# EAGLE board rizon-smd (EAGLE 8.4.1)
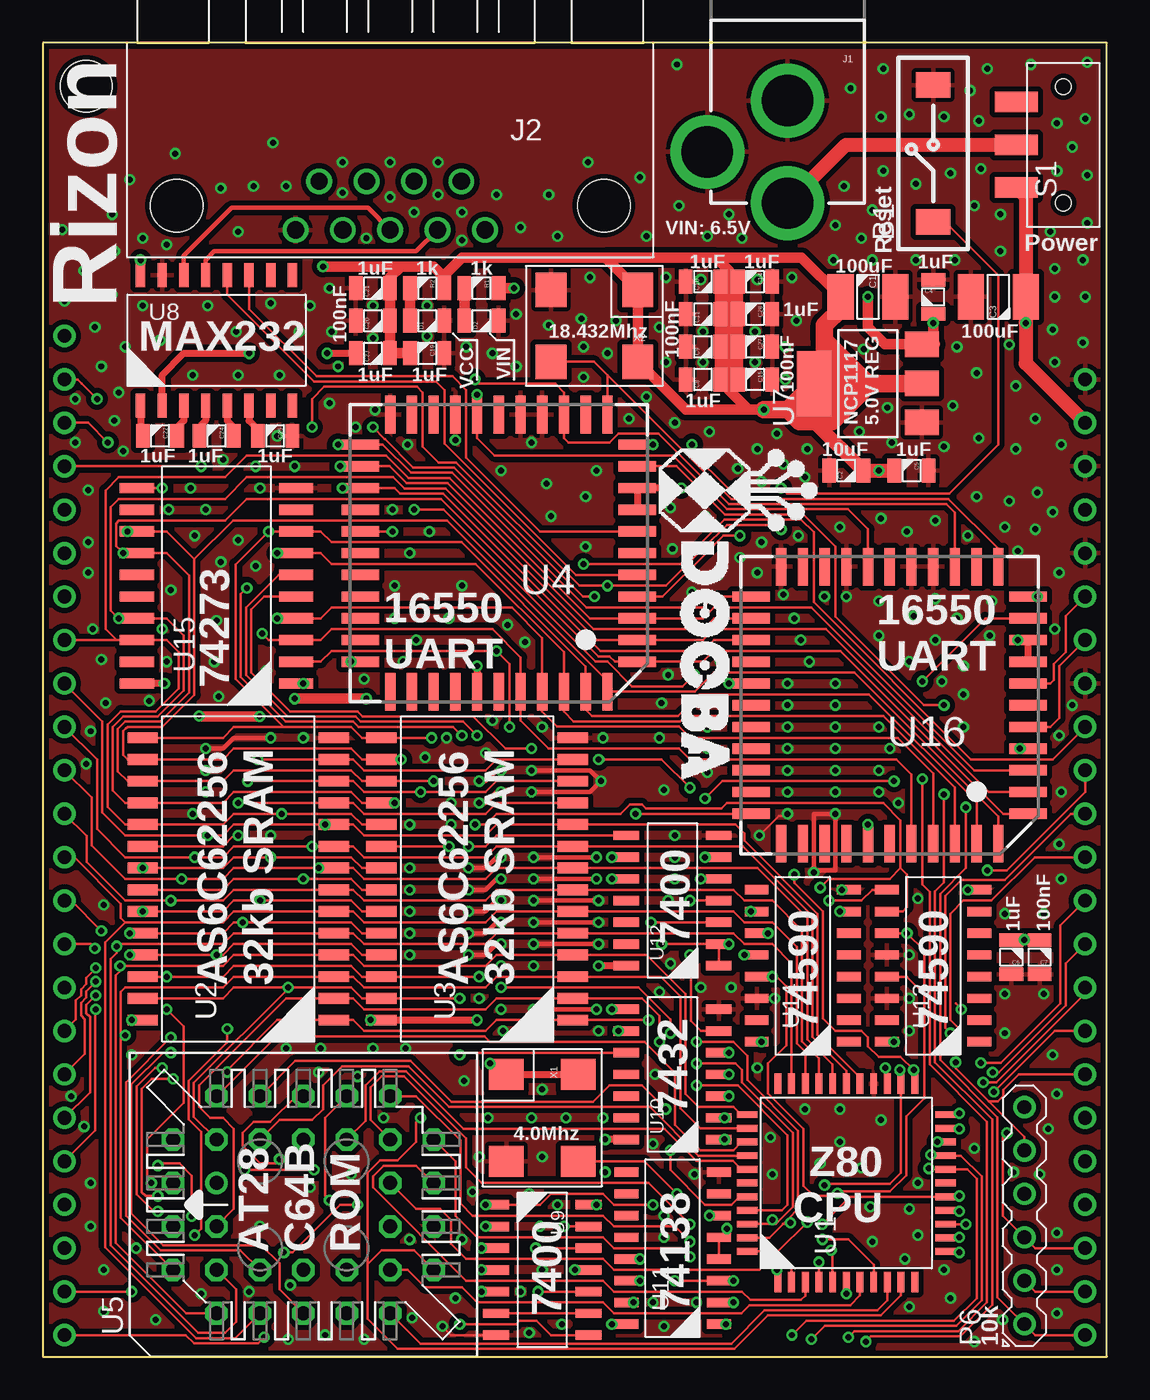
[diagram p5: board, top side]
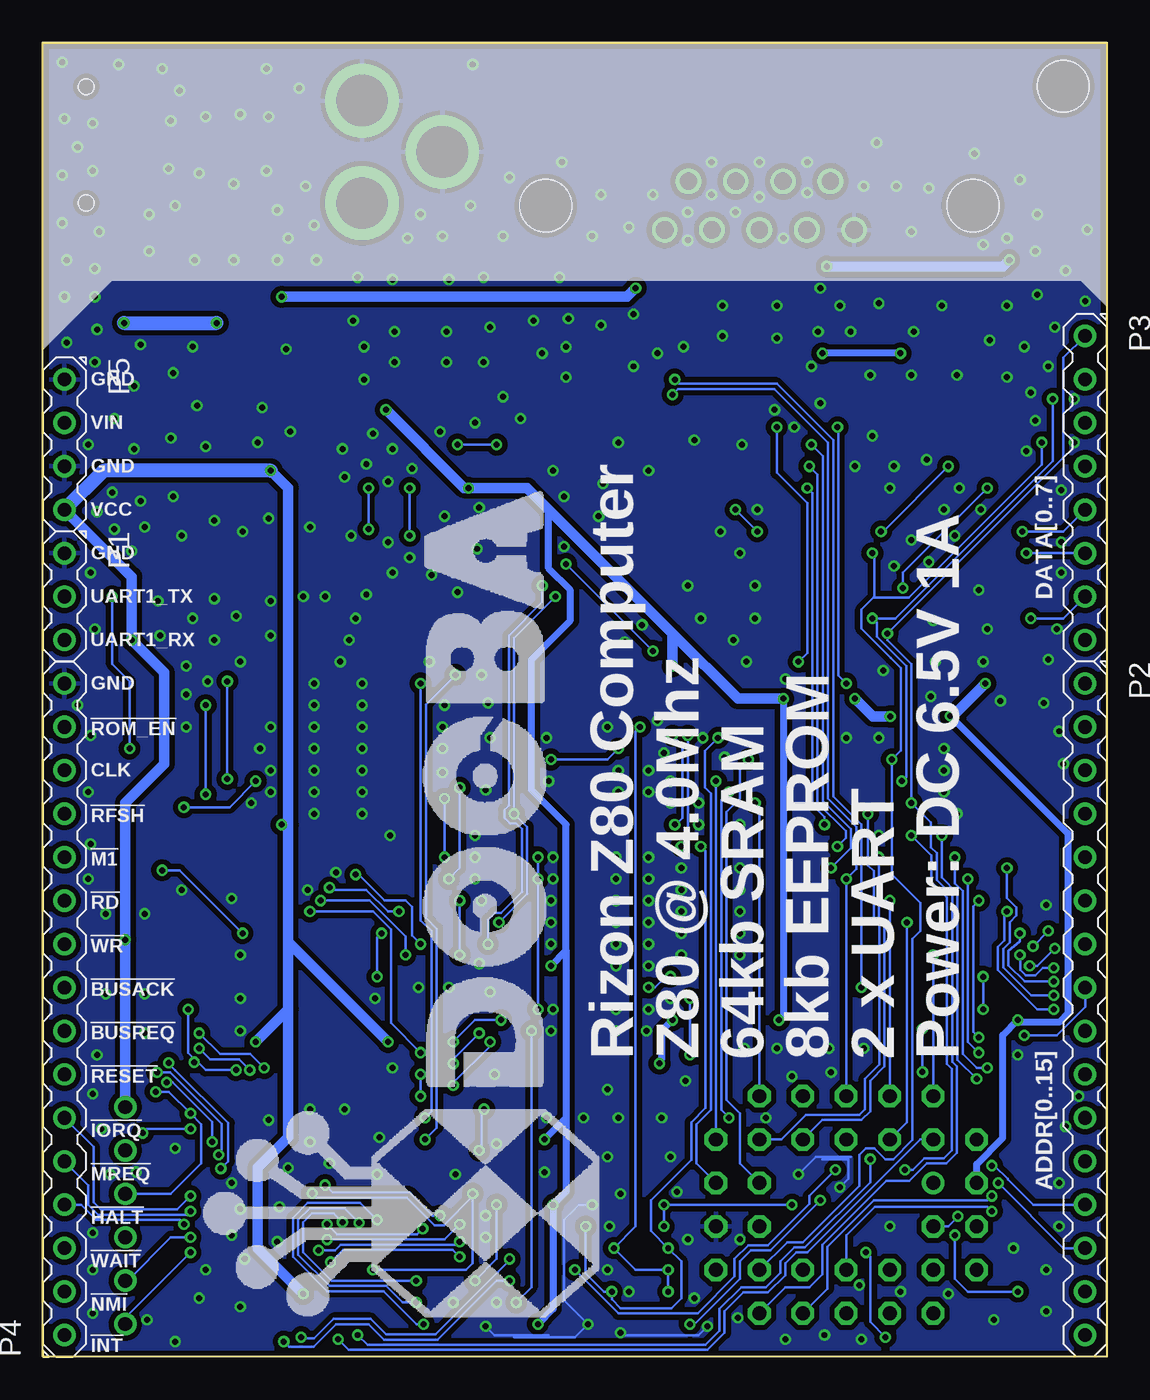
[diagram p6: board, bottom side, seen from below]

Size 62.23 x 76.83 mm. Coordinates in mm from the lower left corner, seen from the top.
Outline: 62.23,0 62.23,76.83 0,76.83 0,0 62.23,0
Copper layers (1*16): Top 0.035mm / dielectric 1.5mm / Bottom 0.035mm
Design rules "dooba": minimum track width 6mil, minimum drill 12mil, track to track 6mil, track to pad 6mil, pad to pad 6mil, via to via 6mil, smd to smd 0mil, copper to edge 10mil, drill to drill 10mil, minimum pad ring 10mil, minimum via ring 6mil, stop-mask expansion 2mil, vias tented up to drill 25mil, thermal gap 10mil
Holes 3 mm at 2.54,74.3

## Footprints (pad centres in the part's own frame; a part is rotated, then mirrored left to right if it is on the bottom)
TACTSW_MICRO3X6 = smd 1.5 x 2: 1 -4,0; 2 4,0
1210 = smd 1.524 x 2.678: 1 -1.6,0; 2 1.6,0
0805 = smd 0.8 x 1.4: 1 -1,0; 2 1,0
PWRJACK_5521 = drill 2.997 pad 4.318: GND 0,0.08; GNDBREAK 4.7,3.08; PWR 0,6.08
A-DS09AKG = drill 1: 1 -5.54,1.42; 2 -2.77,1.42; 3 0,1.42; 4 2.77,1.42; 5 5.54,1.42; 6 -4.155,-1.42; 7 -1.385,-1.42; 8 1.385,-1.42; 9 4.155,-1.42 | hole 3.05: -12.495,0; 12.495,0
PIN_3 = drill 0.8: 1 -2.54,0; 2 0,0; 3 2.54,0
PIN_16 = drill 0.8: 1 -19.05,0; 2 -16.51,0; 3 -13.97,0; 4 -11.43,0; 5 -8.89,0; 6 -6.35,0; 7 -3.81,0; 8 -1.27,0; 9 1.27,0; 10 3.81,0; 11 6.35,0; 12 8.89,0; 13 11.43,0; 14 13.97,0; 15 16.51,0; 16 19.05,0
PIN_8 = drill 0.8: 1 -8.89,0; 2 -6.35,0; 3 -3.81,0; 4 -1.27,0; 5 1.27,0; 6 3.81,0; 7 6.35,0; 8 8.89,0
PIN_4 = drill 0.8: 1 -3.81,0; 2 -1.27,0; 3 1.27,0; 4 3.81,0
PIN_6 = drill 0.8: 1 -6.35,0; 2 -3.81,0; 3 -1.27,0; 4 1.27,0; 5 3.81,0; 6 6.35,0
JS102011 = smd 1.2 x 2.5: 1 -2.5,2.75; 2 0,2.75; 3 2.5,2.75 | hole 0.9: -3.4,0; 3.4,0
QFP44 = smd 1.2 x 0.4: 1 -5.8,4; 2 -5.8,3.2; 3 -5.8,2.4; 4 -5.8,1.6; 5 -5.8,0.8; 6 -5.8,0; 7 -5.8,-0.8; 8 -5.8,-1.6; 9 -5.8,-2.4; 10 -5.8,-3.2; 11 -5.8,-4; 23 5.8,-4; 24 5.8,-3.2; 25 5.8,-2.4; 26 5.8,-1.6; 27 5.8,-0.8; 28 5.8,0; 29 5.8,0.8; 30 5.8,1.6; 31 5.8,2.4; 32 5.8,3.2; 33 5.8,4 | smd 0.4 x 1.2: 12 -4,-5.8; 13 -3.2,-5.8; 14 -2.4,-5.8; 15 -1.6,-5.8; 16 -0.8,-5.8; 17 0,-5.8; 18 0.8,-5.8; 19 1.6,-5.8; 20 2.4,-5.8; 21 3.2,-5.8; 22 4,-5.8; 34 4,5.8; 35 3.2,5.8; 36 2.4,5.8; 37 1.6,5.8; 38 0.8,5.8; 39 0,5.8; 40 -0.8,5.8; 41 -1.6,5.8; 42 -2.4,5.8; 43 -3.2,5.8; 44 -4,5.8
SOP28 = smd 0.635 x 1.778: P$1 -8.255,-5.588; P$2 -6.985,-5.588; P$3 -5.715,-5.588; P$4 -4.445,-5.588; P$5 -3.175,-5.588; P$6 -1.905,-5.588; P$7 -0.635,-5.588; P$8 0.635,-5.588; P$9 1.905,-5.588; P$10 3.175,-5.588; P$11 4.445,-5.588; P$12 5.715,-5.588; P$13 6.985,-5.588; P$14 8.255,-5.588; P$15 8.255,5.588; P$16 6.985,5.588; P$17 5.715,5.588; P$18 4.445,5.588; P$19 3.175,5.588; P$20 1.905,5.588; P$21 0.635,5.588; P$22 -0.635,5.588; P$23 -1.905,5.588; P$24 -3.175,5.588; P$25 -4.445,5.588; P$26 -5.715,5.588; P$27 -6.985,5.588; P$28 -8.255,5.588
PLCC44 = smd 0.6 x 2.2: 1 0,8.1; 2 -1.27,8.1; 3 -2.54,8.1; 4 -3.81,8.1; 5 -5.08,8.1; 6 -6.35,8.1; 18 -6.35,-8.1; 19 -5.08,-8.1; 20 -3.81,-8.1; 21 -2.54,-8.1; 22 -1.27,-8.1; 23 0,-8.1; 24 1.27,-8.1; 25 2.54,-8.1; 26 3.81,-8.1; 27 5.08,-8.1; 28 6.35,-8.1; 40 6.35,8.1; 41 5.08,8.1; 42 3.81,8.1; 43 2.54,8.1; 44 1.27,8.1 | smd 2.2 x 0.6: 7 -8.1,6.35; 8 -8.1,5.08; 9 -8.1,3.81; 10 -8.1,2.54; 11 -8.1,1.27; 12 -8.1,0; 13 -8.1,-1.27; 14 -8.1,-2.54; 15 -8.1,-3.81; 16 -8.1,-5.08; 17 -8.1,-6.35; 29 8.1,-6.35; 30 8.1,-5.08; 31 8.1,-3.81; 32 8.1,-2.54; 33 8.1,-1.27; 34 8.1,0; 35 8.1,1.27; 36 8.1,2.54; 37 8.1,3.81; 38 8.1,5.08; 39 8.1,6.35
PLCC-S32--SOCKET = drill 0.813: 1 1.27,5.08 | drill 0.813 octagon: 2 -1.27,7.62; 3 -1.27,5.08; 4 -3.81,7.62; 5 -6.35,5.08; 6 -3.81,5.08; 7 -6.35,2.54; 8 -3.81,2.54; 9 -6.35,0; 10 -3.81,0; 11 -6.35,-2.54; 12 -3.81,-2.54; 13 -6.35,-5.08; 14 -3.81,-7.62; 15 -3.81,-5.08; 16 -1.27,-7.62; 17 -1.27,-5.08; 18 1.27,-7.62; 19 1.27,-5.08; 20 3.81,-7.62; 21 6.35,-5.08; 22 3.81,-5.08; 23 6.35,-2.54; 24 3.81,-2.54; 25 6.35,0; 26 3.81,0; 27 6.35,2.54; 28 3.81,2.54; 29 6.35,5.08; 30 3.81,7.62; 31 3.81,5.08; 32 1.27,7.62
SOT223 = smd 1.499 x 2.007: 1 -2.261,-3.15; 2 0.025,-3.15; 3 2.311,-3.15 | smd 3.81 x 2.007: 4 0,3.15
SO16 = smd 0.55 x 1.4: P$1 -4.445,-3.81; P$2 -3.175,-3.81; P$3 -1.905,-3.81; P$4 -0.635,-3.81; P$5 0.635,-3.81; P$6 1.905,-3.81; P$7 3.175,-3.81; P$8 4.445,-3.81; P$9 4.445,3.81; P$10 3.175,3.81; P$11 1.905,3.81; P$12 0.635,3.81; P$13 -0.635,3.81; P$14 -1.905,3.81; P$15 -3.175,3.81; P$16 -4.445,3.81
SOIC14 = smd 0.55 x 1.5: P$1 -3.81,-2.7; P$2 -2.54,-2.7; P$3 -1.27,-2.7; P$4 0,-2.7; P$5 1.27,-2.7; P$6 2.54,-2.7; P$7 3.81,-2.7; P$8 3.81,2.7; P$9 2.54,2.7; P$10 1.27,2.7; P$11 0,2.7; P$12 -1.27,2.7; P$13 -2.54,2.7; P$14 -3.81,2.7
SOIC16 = smd 0.55 x 1.4: P$1 -4.445,-2.7; P$2 -3.175,-2.7; P$3 -1.905,-2.7; P$4 -0.635,-2.7; P$5 0.635,-2.7; P$6 1.905,-2.7; P$7 3.175,-2.7; P$8 4.445,-2.7; P$9 4.445,2.7; P$10 3.175,2.7; P$11 1.905,2.7; P$12 0.635,2.7; P$13 -0.635,2.7; P$14 -1.905,2.7; P$15 -3.175,2.7; P$16 -4.445,2.7
SO20 = smd 0.6 x 2: P$1 -5.715,-4.65; P$2 -4.445,-4.65; P$3 -3.175,-4.65; P$4 -1.905,-4.65; P$5 -0.635,-4.65; P$6 0.635,-4.65; P$7 1.905,-4.65; P$8 3.175,-4.65; P$9 4.445,-4.65; P$10 5.715,-4.65; P$11 5.715,4.65; P$12 4.445,4.65; P$13 3.175,4.65; P$14 1.905,4.65; P$15 0.635,4.65; P$16 -0.635,4.65; P$17 -1.905,4.65; P$18 -3.175,4.65; P$19 -4.445,4.65; P$20 -5.715,4.65
OSC4-SMD-7X5 = smd 1.8 x 2: P$1 -2.54,-2.1; P$2 2.54,-2.1; P$3 2.54,2.1; P$4 -2.54,2.1

## Placement (x,y rotation side)
B1  TACTSW_2MICRO3X6  [TACTSW_MICRO3X6]  52.07,70.36 90 top
C1  100uF  [1210]  48.26,61.98 180 top
C2  10uF  [0805]  46.99,51.82 0 top
C3  100uF  [1210]  55.88,61.98 0 top
C4  1uF  [0805]  52.07,61.98 270 top
C5  1uF  [0805]  50.8,51.82 180 top
C6  1uF  [0805]  56.64,23.37 90 top
C7  100nF  [0805]  58.29,23.37 90 top
C8  1uF  [0805]  38.61,57.15 0 top
C9  100nF  [0805]  38.61,59.05 0 top
C10  1uF  [0805]  38.61,62.87 0 top
C11  100nF  [0805]  38.61,60.96 0 top
C14  1uF  [0805]  41.66,62.87 180 top
C15  100nF  [0805]  41.66,57.15 180 top
C19  1uF  [0805]  22.48,58.67 180 top
C20  100nF  [0805]  19.3,60.58 0 top
C21  1uF  [0805]  19.3,62.48 0 top
C22  1uF  [0805]  6.86,53.85 180 top
C23  1uF  [0805]  19.3,58.67 0 top
C24  1uF  [0805]  10.16,53.85 180 top
C25  1uF  [0805]  13.59,53.85 180 top
C26  1uF  [0805]  41.66,60.96 180 top
C27  100nF  [0805]  41.66,59.05 180 top
D1  VCC  [0805]  22.48,60.58 0 top
D2  VIN  [0805]  25.65,60.58 0 top
J1  PWRJACK5521  [PWRJACK_5521]  43.56,73.53 180 top
J2  DB9A-DS09AKG  [A-DS09AKG]  20.32,67.31 180 top
P1  UART1(GND-TX-RX)  [PIN_3]  60.96,44.45 270 bottom
P2  ADDR  [PIN_16]  1.27,20.32 270 bottom
P3  DATA  [PIN_8]  1.27,50.8 270 bottom
P4  CTL  [PIN_16]  60.96,20.32 90 bottom
P5  PWR  [PIN_4]  60.96,53.34 270 bottom
P6  10k  [PIN_6]  57.4,8.26 90 top
R1  1k  [0805]  25.65,62.48 180 top
R2  1k  [0805]  22.48,62.48 180 top
S1  SWITCH_SPDT  [JS102011]  59.69,70.87 90 top
U1  Z8400LQFP  [QFP44]  46.99,10.16 90 top
U2  AS6C62256SOP28  [SOP28]  11.43,27.94 90 top
U3  AS6C62256SOP28  [SOP28]  25.4,27.94 90 top
U4  PC16550DPLCC-SMD  [PLCC44]  26.67,46.99 180 top
U5  AT28C64BPLCC  [PLCC-S32--SOCKET]  15.24,8.89 90 top
U7  NCP1117SOT223  [SOT223]  48.26,56.9 90 top
U8  MAX232NNS  [SO16]  10.16,59.44 0 top
U9  7400SOIC  [SOIC14]  29.21,5.08 270 top
U10  7432SOIC  [SOIC14]  36.83,16.51 90 top
U11  74138SOIC  [SOIC16]  36.83,6.35 90 top
U12  7400SOIC  [SOIC14]  36.83,26.67 90 top
U13  74590SOIC  [SOIC16]  52.07,22.86 90 top
U14  74590SOIC  [SOIC16]  44.45,22.86 90 top
U15  74273DW  [SO20]  10.16,45.09 90 top
U16  PC16550DPLCC-SMD  [PLCC44]  49.53,38.1 180 top
X1  4.0Mhz  [OSC4-SMD-7X5]  29.21,13.97 270 top
X2  18.432Mhz  [OSC4-SMD-7X5]  32.26,60.28 180 top

## Tracks (layer width: path | path; a pad name or v marks a point on that pad's centre or on a via)
!ADDR15  (via drill 0.35)
  Top 0.152: U9.P$3 v25.65,6.35 | U9.P$10 v28.96,3.81 | v23.75,29.84 U3.P$20 | v30.48,7.62 U9.P$13
  Bottom 0.152: v23.75,29.84 23.47,29.57 23.47,14.55 24.31,13.71 24.31,11.51 26.67,9.14 26.67,7.37 v25.65,6.35 24.89,5.59 24.89,3.43 25.48,2.85 28.45,2.85 28.96,3.35 v28.96,3.81 29.41,3.81 30.48,4.88 v30.48,7.62
!BUSACK  (via drill 0.35)
  Top 0.152: U1.20 52.78,12.57 v52.32,12.57 | v54.99,16.05 55.75,16.05 60.96,21.26 P4.9
  Bottom 0.152: v52.32,12.57 52.32,13.74 54.63,16.05 v54.99,16.05
!BUSREQ  (via drill 0.35)
  Top 0.152: U1.22 53.53,14.16 v53.59,14.22 | v55.63,15.49 59.18,19.05 P4.8
  Bottom 0.152: P6.4 54.74,9.53 52.96,11.3 52.96,13.59 v53.59,14.22 54.86,15.49 v55.63,15.49
!HALT  (via drill 0.35)
  Top 0.152: U1.14 52.8,7.75 v53.97,7.75
  Bottom 0.152: v53.97,7.75 54.23,8 59.1,8 59.99,8.89 P4.4
!INT  (via drill 0.35)
  Top 0.152: U1.12 53.53,6.16 v53.59,6.1 | U12.P$6 v38.73,29.21 | v38.73,32.64 39.75,33.66 v49.78,33.66 | v53.98,32.13 53.98,28.57 52.48,27.08 52.48,23.62 | 52.48,23.62 | 52.48,23.62 52.48,17.35 55.83,13.99 55.83,3.48 P6.1 58.04,1.27 P4.1
  Bottom 0.152: v53.59,6.1 57.4,2.29 P6.1 | v49.78,33.66 51.31,32.13 v53.98,32.13 | v38.73,29.21 v38.73,32.64
!IODEV0  (via drill 0.35)
  Top 0.152: 33.66,3.17 U11.P$15 v34.54,3.17 | v33.66,19.05 U10.P$9
  Bottom 0.152: v33.66,19.05 33.66,4.06 v34.54,3.17
!IODEV1  (via drill 0.35)
  Top 0.152: v34.92,4.45 U11.P$14 | v48.13,0.89 48.44,1.19 53.67,1.19 55.52,3.05 55.52,13.87 52.17,17.22 52.17,23.75 | 52.17,23.75 | U4.16 37.06,52.07 39.88,49.25 44.48,49.25 46.35,47.37 46.35,43.28 51.53,38.1 v52.7,38.1 | 52.17,23.75 52.17,27.2 52.7,27.74 v52.7,32.89
  Bottom 0.152: v34.92,4.45 35.69,4.45 39.13,1 42.28,1 43.18,1.91 45.09,1.91 46.4,0.59 47.83,0.59 v48.13,0.89 | v52.7,32.89 v52.7,38.1
!IODEV2  (via drill 0.35)
  Top 0.152: v34.92,5.71 U11.P$13 | v47.12,1.14 47.47,1.5 53.54,1.5 55.22,3.18 55.22,13.74 51.87,17.09 51.87,27.18 51.44,27.61 v51.44,33.78 | v51.44,39.5 55.12,43.18 U16.16
  Bottom 0.152: v34.92,5.71 34.92,5.64 39.26,1.31 42.15,1.31 43.05,2.21 45.21,2.21 46.35,1.07 47.04,1.07 v47.12,1.14 | v51.44,33.78 v51.44,39.5
!IORQ  (via drill 0.35)
  Top 0.152: U11.P$4 U11.P$5 40.01,7.46 v40.01,7.49 | v45.59,7.75 47.21,9.36 U1.16 53.56,9.36 v53.59,9.4
  Bottom 0.152: v40.01,7.49 40.34,7.16 45.01,7.16 v45.59,7.75 | v53.59,9.4 54.38,8.61 58.85,8.61 59.26,9.02 59.26,12.27 P4.6
!M1  (via drill 0.35)
  Top 0.152: U11.P$6 v38.99,8.26 | v45.72,10.03 45.79,10.1 49.55,10.1 50.19,10.74 U1.24 50.19,16.69 v50.12,16.76 | v53.09,18.03 53.09,18.14 53.64,18.69 53.64,19.15 53.09,19.71 53.09,25.91 53.85,26.67 55.47,26.67 58.01,29.21 P4.12
  Bottom 0.152: v38.99,8.26 39.45,8.26 40.79,9.6 45.29,9.6 v45.72,10.03 | v50.12,16.76 50.76,17.4 52.45,17.4 v53.09,18.03
!MREQ  (via drill 0.35)
  Top 0.152: U1.15 53.54,8.56 v53.59,8.51
  Bottom 0.152: v53.59,8.51 53.8,8.31 58.98,8.31 59.56,8.89 59.56,10.03 P4.5
!NMI  (via drill 0.35)
  Top 0.152: U1.13 53.57,6.96 v53.59,6.99 | P6.2 58.04,3.81 P4.2
  Bottom 0.152: v53.59,6.99 54.74,6.99 57.28,4.45 P6.2
!RAM_BANK0_CE  (via drill 0.35)
  Top 0.152: U9.P$11 v31.11,5.08 | v15.88,10.92 v11.81,10.92 | U2.P$20 10.54,29.84 11.18,30.48 v11.43,30.48
  Bottom 0.152: v31.11,5.08 28.57,2.54 23.93,2.54 21.77,4.7 21.77,5.71 20.95,6.53 19.81,6.53 17.4,8.94 17.4,9.4 v15.88,10.92 | v11.81,10.92 11.35,10.92 10.67,11.61 9.52,11.61 9.07,12.06 9.07,16.84 9.35,17.12 9.35,26.85 10.26,27.76 10.26,29.31 v11.43,30.48
!RD  (via drill 0.35)
  Top 0.152: U3.P$22 18.67,27.3 18.03,27.94 v15.24,27.94 11.18,27.94 10.54,27.3 U2.P$22 | U16.24 48.26,48.39 47.09,49.55 40.01,49.55 36.86,52.7 26.42,52.7 25.4,53.72 U4.24 v25.4,56.26 | U5.25 14.81,15.24 13.31,13.74 12.34,13.74 11.68,13.08 11.68,12.32 12.7,11.3 13.59,11.3 v13.84,11.56 | v43.81,1.27 44.65,2.11 53.29,2.11 54.61,3.43 54.61,10.41 54.06,10.96 U1.18 51.86,10.96 v51.82,11 | v54.86,17.19 56.03,17.19 59.51,20.67 59.51,25.22 P4.11
  Bottom 0.152: U5.25 v15.24,27.94 14.66,28.52 14.66,30.99 16.31,32.64 16.31,53.47 19.43,56.59 25.07,56.59 v25.4,56.26 | v13.84,11.56 13.84,10.21 17.65,6.4 18.29,6.4 19.1,5.59 19.1,4.9 19.94,4.06 21.39,4.06 22.66,2.79 22.66,1.52 23.48,0.7 43.24,0.7 v43.81,1.27 | v51.82,11 51.39,11.43 51.39,13.66 54.48,16.76 | 54.48,16.76 | v54.86,17.19 54.86,17.14 54.48,16.76
!RESET  (via drill 0.35)
  Top 0.152: U1.23 50.99,16.7 v50.93,16.76 50.16,17.53 48.9,17.53 48.26,18.16 48.26,18.67 47.88,19.05 46.35,19.05 45.62,19.79 45.62,26.03 43.94,27.71 v43.94,28.19 | U12.P$2 U12.P$1 | U15.P$1 v15.24,39.37 | v15.75,54.36 15.75,56.01 16.46,56.72 21.89,56.72 22.23,56.39 22.23,53.21 23.14,52.3 24.18,52.3 31.39,45.09 v33.02,45.09 36.45,45.09 38.65,47.28 | v43.18,50.8 43.51,50.47 53.01,50.47 55.88,53.34 55.88,63.25 52.77,66.36 B1.1 | v36.2,24.13 U12.P$2 | v40.13,24.13 U12.P$2 | 38.65,47.28 | 38.65,47.28 40.01,48.64 42.93,48.64 v43.18,48.39 | v53.72,20.32 53.39,20.65 | v53.38,17.23 53.38,16.87 55.32,14.93 | P6.5 57.4,12.85 55.32,14.93 | 55.32,14.93 55.32,14.94 55.86,14.94 56.18,15.26 56.18,15.62 57.07,16.51 P4.7
  Bottom 0.152: v50.93,16.76 52.7,16.76 53.15,17.21 | v15.24,39.37 15.7,39.83 15.7,54.3 v15.75,54.36 | v36.2,24.13 36.2,25.55 35.79,25.96 35.44,25.96 34.21,27.18 34.21,30.86 34.55,31.19 34.9,31.19 35.23,31.52 35.23,31.98 34.98,32.23 34.98,42.16 33.02,44.12 v33.02,45.09 | v43.94,28.19 43.77,28.19 42.24,26.67 41.02,26.67 40.64,26.29 40.64,24.64 v40.13,24.13 | v43.18,48.39 v43.18,50.8 | v53.72,20.32 53.72,17.78 53.15,17.21 | 53.15,17.21 53.36,17.21 v53.38,17.23
!RFSH  (via drill 0.35)
  Top 0.152: U1.25 49.39,16.78 v49.28,16.89 | v53.09,18.92 52.78,19.23 52.78,26.95 53.72,27.89 56.26,27.89 60.12,31.75 P4.13
  Bottom 0.152: v49.28,16.89 50.09,17.7 51.87,17.7 v53.09,18.92
!ROM_CE  (via drill 0.35)
  Top 0.152: U5.23 16.51,13.97 16.51,9.4 v16.76,9.14 | U9.P$8 29.72,1.27 28.88,2.11 27.89,2.11 27.69,1.91 v24.38,1.91
  Bottom 0.152: v16.76,9.14 19.68,6.22 20.83,6.22 21.46,5.59 21.46,4.57 24.13,1.91 v24.38,1.91
!ROM_EN  (via drill 0.35)
  Top 0.152: U15.P$2 16.26,40.64 16.89,41.27 v26.54,41.27 27.3,40.51 v27.3,36.83 | v28.83,6.35 U9.P$12 | U9.P$4 v25.65,5.08 | U9.P$5 v25.65,3.81 | v31.62,46.35 37.29,46.35 39.88,48.95 44.35,48.95 45.09,48.21 45.09,44.12 54.28,34.92 59.05,34.92 P4.15
  Bottom 0.152: v27.3,36.83 27.56,36.58 27.56,7.62 v28.83,6.35 27.56,5.08 v25.65,5.08 v25.65,3.81 | v26.54,41.27 v31.62,46.35
!SCR0_CP  (via drill 0.35)
  Top 0.152: U10.P$8 v33.27,20.32 | v33.27,29.21 U12.P$9 | U12.P$10 v33.27,27.94
  Bottom 0.152: v33.27,20.32 v33.27,27.94 v33.27,29.21
!TIMER_CLR  (via drill 0.35)
  Top 0.152: U15.P$6 13.79,45.72 11.89,43.81 11.89,39.88 14.33,37.44 18.29,37.44 18.59,37.13 24.59,37.13 v25.4,36.32 | v25.27,31.11 25.91,31.11 26.54,31.75 33.78,31.75 34.34,32.31 35.03,32.31 35.28,32.05 39.67,32.05 40.01,32.38 49.15,32.38 50.16,31.37 50.16,28.57 | 50.16,28.57 50.55,28.19 50.55,26.29 50.29,26.04 U13.P$10 | U14.P$10 v41.4,26.04 | v45.47,27.43 45.97,27.94 49.53,27.94 50.16,28.57
  Bottom 0.152: v25.4,36.32 24.82,35.74 24.82,31.5 25.2,31.11 v25.27,31.11 | v41.4,26.04 42.04,26.04 43.31,27.3 45.34,27.3 v45.47,27.43
!WAIT  (via drill 0.35)
  Top 0.152: U1.21 53.57,13.36 v53.59,13.34 | v56.39,13.08 56.13,12.83 56.13,8.26 P6.3 58.04,6.35 P4.3
  Bottom 0.152: v53.59,13.34 56.13,13.34 v56.39,13.08
!WR  (via drill 0.35)
  Top 0.152: U2.P$27 10.54,20.95 11.18,21.59 v14.35,21.59 14.43,21.59 | 14.43,21.59 18.03,21.59 18.67,20.95 U3.P$27 v24.38,20.95 | U5.31 8.84,14.02 8.84,16 14.43,21.59 | U16.20 53.34,49.35 52.83,49.86 40.13,49.86 36.02,53.98 33.66,53.98 33.15,53.47 30.73,53.47 30.48,53.72 U4.20 30.48,56.39 29.97,56.9 25.53,56.9 v25.27,57.15 | v44.96,1.02 45.74,1.8 53.41,1.8 54.91,3.3 54.91,10.54 53.7,11.76 U1.19 51.99,11.76 v51.94,11.81 | v24.38,17.65 24.51,17.78 U10.P$10 | v55.55,16.63 55.9,16.63 59.82,20.55 59.82,22.99 P4.10
  Bottom 0.152: U5.31 10.92,12.7 17.53,6.1 18.16,6.1 18.8,5.46 18.8,4.78 19.81,3.76 21.26,3.76 22.35,2.67 22.35,1.4 23.36,0.39 44.34,0.39 v44.96,1.02 | v14.35,21.59 14.35,31.11 16,32.77 16,53.59 19.3,56.9 25.02,56.9 v25.27,57.15 | v24.38,20.95 v24.38,17.65 | v51.94,11.81 51.77,11.99 51.77,13.62 54.79,16.63 v55.55,16.63
ADDR0  (via drill 0.35)
  Top 0.152: U1.27 47.79,16.34 45.31,18.82 45.31,25.91 41.02,30.2 41.02,30.61 40.51,31.11 U3.P$10 26.54,31.11 25.91,30.48 18.8,30.48 18.16,31.11 U2.P$10 v16.51,31.11 11.18,31.11 10.54,30.48 v9.65,30.48 4.83,30.48 3.48,31.83 3.48,37.16 P2.1 | v7.62,16.26 6.37,16.26 5.79,15.67 5.79,9.63 6.02,9.4 v6.73,9.4 | U16.31 39.24,41.91 38.61,41.27 32.61,41.27 23.42,50.47 20.9,50.47 20.57,50.8 U4.31 v17.53,50.8
  Bottom 0.152: v6.73,9.4 6.99,9.14 13.62,9.14 16.33,6.43 16.33,3.99 U5.11 | v7.62,16.26 8.74,17.37 8.74,27.1 9.65,28.02 v9.65,30.48 | v16.51,31.11 16.51,31.55 17.22,32.26 17.22,50.49 v17.53,50.8
ADDR1  (via drill 0.35)
  Top 0.152: U1.28 46.99,16.71 45.01,18.7 45.01,25.78 40.94,29.84 U3.P$9 26.54,29.84 25.91,29.21 18.8,29.21 18.16,29.84 U2.P$9 v15.75,29.84 11.18,29.84 10.54,29.21 v8.89,29.21 4.83,29.21 3.17,30.86 3.17,34.92 P2.2 | v6.99,16.89 6.58,16.89 5.49,15.8 5.49,9.5 6.48,8.51 v6.73,8.51 | U16.30 39.24,43.18 38.61,42.55 32.2,42.55 23.67,51.08 21.28,51.08 20.29,52.07 U4.30 v17.4,52.07
  Bottom 0.152: v6.73,8.51 6.99,8.76 13.57,8.76 15.24,7.09 U5.10 | v6.99,16.89 7.62,16.89 8.43,17.7 8.43,27.23 8.89,27.69 v8.89,29.21 | v15.75,29.84 15.27,30.33 15.27,30.74 16.92,32.39 16.92,51.59 v17.4,52.07
ADDR2  (via drill 0.35)
  Top 0.152: U1.29 46.19,17.08 44.7,18.57 44.7,25.65 41.78,28.57 U3.P$8 26.54,28.57 25.91,27.94 18.8,27.94 18.16,28.57 U2.P$8 v16.13,28.57 11.18,28.57 10.54,27.94 v8.13,27.94 4.83,27.94 2.87,29.9 2.87,32.69 P2.3 | U5.9 13.84,3.94 13.84,5.46 12.78,6.53 7.03,6.53 5.18,8.38 5.18,15.93 7.04,17.78 v7.49,17.78 | U16.29 39.24,44.45 38.61,43.81 31.8,43.81 23.92,51.69 21.53,51.69 19.88,53.34 U4.29 v17.27,53.34
  Bottom 0.152: v7.49,17.78 8.13,18.41 v8.13,27.94 | v16.13,28.57 14.96,29.74 14.96,30.86 16.61,32.51 16.61,52.68 v17.27,53.34
ADDR3  (via drill 0.35)
  Top 0.152: U1.30 45.39,17.45 44.4,18.44 44.4,24.94 42.67,26.67 41.02,26.67 40.39,27.3 U3.P$7 26.54,27.3 25.91,26.67 18.8,26.67 18.16,27.3 U2.P$7 11.18,27.3 10.54,26.67 v7.49,26.67 4.83,26.67 2.56,28.93 2.56,30.45 P2.4 | U5.8 11.56,6.22 6.91,6.22 4.88,8.25 4.88,16.05 v7.49,18.67
  Bottom 0.152: v7.49,18.67 7.82,19 7.82,26.34 v7.49,26.67
ADDR4
  Top 0.152: U1.31 44.59,17.82 44.09,18.32 44.09,23.98 42.67,25.4 41.02,25.4 40.39,26.04 U3.P$6 26.54,26.04 25.91,25.4 18.8,25.4 18.16,26.04 U2.P$6 11.18,26.04 10.54,25.4 4.83,25.4 | U5.7 11.25,1.09 8.97,1.09 3.66,6.4 3.66,24.23 4.83,25.4 | 4.83,25.4 4.57,25.65 4.57,26.49 1.85,29.21 P2.5
ADDR5  (via drill 0.35)
  Top 0.152: U1.32 43.79,23.01 42.67,24.13 41.02,24.13 40.39,24.77 U3.P$5 26.54,24.77 25.91,24.13 18.8,24.13 18.16,24.77 U2.P$5 11.18,24.77 10.54,24.13 4.45,24.13 v4.32,24 4.32,23.62 3.96,23.27 3.96,6.53 9.09,1.4 10.67,1.4 11.3,2.03 11.3,3.94 U5.6 | v3.43,24.89 1.65,26.67 P2.6
  Bottom 0.152: v3.43,24.89 v4.32,24
ADDR6  (via drill 0.35)
  Top 0.152: U1.34 40.83,14.16 40.39,14.61 38.35,14.61 37.59,15.37 37.59,21.21 35.31,23.5 U3.P$4 26.54,23.5 25.91,22.86 18.8,22.86 18.16,23.5 U2.P$4 11.18,23.5 10.54,22.86 4.83,22.86 4.64,22.67 | U5.5 8.38,2.54 4.27,6.66 4.27,22.3 4.64,22.67 | v3.05,23.88 2.79,24.13 P2.7 | v4.52,22.86 4.64,22.74 4.64,22.67
  Bottom 0.152: v3.05,23.88 4.06,22.86 v4.52,22.86
ADDR7  (via drill 0.35)
  Top 0.152: U1.35 38.46,13.36 37.29,14.53 37.29,21.08 36.15,22.23 U3.P$3 26.54,22.23 25.91,21.59 18.8,21.59 18.16,22.23 U2.P$3 11.18,22.23 10.54,21.59 4.83,21.59 4.57,21.34 4.57,18.92 | U5.4 4.57,8.13 4.57,18.92 | 4.57,18.92 4.7,18.8 v4.82,18.8
  Bottom 0.152: v4.82,18.8 2.92,18.8 1.27,20.45 P2.8
ADDR8  (via drill 0.35)
  Top 0.152: U1.36 40.87,12.56 40.38,12.07 38.47,12.07 36.98,13.56 36.98,16.61 35.18,18.41 26.16,18.41 25.83,18.75 13.66,18.75 U5.29 | U3.P$25 18.67,23.5 18.03,24.13 11.18,24.13 10.54,23.5 v10.16,23.5 U2.P$25 v5.08,23.5 | v3.1,22.74 3.1,22.72 2.55,22.16 2.55,21.79 2.24,21.48 2.24,21.13 1.94,20.82 1.94,19.72 P2.9
  Bottom 0.152: U5.29 v10.16,23.5 | v5.08,23.5 5.07,23.36 5.07,22.63 4.75,22.3 4.19,22.3 3.75,22.74 v3.1,22.74
ADDR9  (via drill 0.35)
  Top 0.152: U1.37 38.35,11.76 35.51,14.61 23.77,14.61 21.39,16.99 19.81,16.99 | 19.81,16.99 | 19.81,16.99 17.5,16.99 16.38,15.88 16.38,14.48 15.75,13.84 13.84,13.84 U5.28 | U3.P$24 18.67,24.77 18.03,25.4 v11.68,25.4 11.18,25.4 10.54,24.77 U2.P$24 v5.08,24.77 | v3.1,21.93 3.1,21.91 2.55,21.36 2.55,21 2.24,20.7 2.24,19.96 2.46,19.74 2.46,17.7 P2.10
  Bottom 0.152: U5.28 11.68,13.72 v11.68,25.4 | v5.08,24.77 5.08,24.28 5.76,23.73 5.76,22.89 4.81,21.93 v3.1,21.93
ADDR10  (via drill 0.35)
  Top 0.152: U1.38 40.86,10.96 40.36,11.46 38.23,11.46 36.35,13.34 24.61,13.34 21.26,16.69 19.69,16.69 18.87,15.87 18.87,13.79 U5.24 | U3.P$21 18.67,28.57 18.03,29.21 v13.34,29.21 11.18,29.21 10.54,28.57 v5.84,28.57 | v3.1,21.13 2.55,20.57 2.55,20.09 2.77,19.87 2.77,15.47 P2.11
  Bottom 0.152: U5.24 16.64,13.84 14.35,13.84 13.84,14.35 13.84,16.13 13.01,16.97 13.01,25.4 13.34,25.73 v13.34,29.21 | v5.84,28.57 5.84,26.82 5.29,26.27 5.29,25.8 5.69,25.4 5.69,24.23 6.07,23.85 6.07,22.76 4.43,21.13 v3.1,21.13
ADDR11  (via drill 0.35)
  Top 0.152: U3.P$23 18.67,26.04 18.03,26.67 v12.7,26.67 11.18,26.67 10.54,26.04 U2.P$23 | U1.40 40.73,9.36 40.26,8.89 38.73,8.89 36.7,10.92 v36.7,12.06 | v36.43,14.48 36.43,14.5 35.05,15.88 33.15,15.88 32.18,14.91 23.9,14.91 21.51,17.3 19.94,17.3 | 19.94,17.3 | 19.94,17.3 14.76,17.3 U5.27 | v3.1,20.32 3.07,20.29 3.07,13.23 P2.12
  Bottom 0.152: v36.7,12.06 36.58,12.19 36.58,14.35 36.45,14.48 v36.43,14.48 | U5.27 v12.7,26.67 | U2.P$23 5.99,25.88 5.99,24.36 6.37,23.98 6.37,22.64 4.06,20.32 v3.1,20.32
  other vias: 5.84,26.04
ADDR12  (via drill 0.35)
  Top 0.152: U1.41 43.23,8.56 43.56,8.89 43.56,12.95 40.64,15.88 v38.23,15.88 | v36.07,18.41 36.07,19.94 35.05,20.95 U3.P$2 26.54,20.95 25.91,20.32 18.8,20.32 18.16,20.95 U2.P$2 14.22,20.95 9.14,15.88 9.14,14.61 9.78,13.97 10.54,13.97 11.18,13.34 11.18,8.64 U5.3 | v8.71,8.21 8.71,10.59 8,11.3 6.86,11.3 v6.73,11.18
  Bottom 0.152: v36.07,18.41 36.07,18.16 38.23,16 v38.23,15.88 | U5.3 9.27,7.62 8.71,8.18 v8.71,8.21 | v6.73,11.18 6.58,11.18 5.79,10.39 5.79,10.37 4.32,8.89 P2.13
ADDR13  (via drill 0.35)
  Top 0.152: U2.P$26 v7.24,22.23 10.54,22.23 11.18,22.86 18.03,22.86 18.67,22.23 U3.P$26 v25.53,22.23 | 42.8,7.76 42.86,7.76 43.87,8.76 43.87,13.08 40.89,16.05 40.89,16.76 40.51,17.14 v38.23,17.14 | 42.8,7.76 U1.42 | v36.7,18.92 36.7,19.73 34.85,21.59 v26.8,21.59 | 42.42,7.76 v42.66,8 v42.67,8 42.8,7.88 42.8,7.76 | v6.35,10.16 6.1,10.41 6.1,12.7 8.23,14.83 8.23,19.33 v7.24,20.32 | U11.P$1 v39.96,1.91
  Bottom 0.152: v38.23,17.14 38.23,17.4 v36.7,18.92 | v26.8,21.59 26.42,21.59 25.78,22.23 v25.53,22.23 | 39.88,1.91 v39.96,1.91 40.36,1.91 42.29,3.83 45.59,3.83 47.6,5.84 47.6,8.13 46.73,8.99 43.66,8.99 v42.67,8 | v7.24,20.32 v7.24,22.23 | v6.35,10.16 2.54,6.35 P2.14
ADDR14  (via drill 0.35)
  Top 0.152: U1.43 42.49,6.96 43.61,8.08 | v38.23,18.41 40.39,18.41 41.2,17.6 41.2,16.18 44.17,13.21 44.17,8.64 43.61,8.08 | v35.43,19.68 U3.P$1 26.54,19.68 25.91,19.05 18.8,19.05 18.16,19.68 U2.P$1 13.72,19.68 10.78,16.75 v10.78,16.65 | 43.29,7.76 43.65,7.76 v43.73,7.84 43.61,7.95 43.61,8.08 | v40.39,3.17 U11.P$2 | v10.79,19.18 10.79,18.39 8.53,16.13 8.53,13.89 9.27,13.16 9.27,7.49 v8.89,7.11 | v5.21,3.81 P2.15
  Bottom 0.152: v38.23,18.41 36.96,19.68 v35.43,19.68 | v40.39,3.17 41.2,3.17 42.16,4.14 45.47,4.14 47.3,5.97 47.3,8 46.61,8.69 44.58,8.69 v43.73,7.84 | v10.78,16.65 10.79,16.66 v10.79,19.18 | v8.89,7.11 8.89,4.57 8.13,3.81 v5.21,3.81
ADDR15  (via drill 0.35)
  Top 0.152: U1.44 42.99,6.16 v44.7,7.87 | v40.39,4.45 U11.P$3 v36.96,4.45 | v35.69,8.89 33.4,8.89 32.77,9.53 29.72,9.53 29.08,8.89 U9.P$1 v25.91,8.89 | v25.91,7.62 U9.P$2 | v18.41,8.89 17.4,8.89 14.61,6.1 v14.1,6.1 | v12.95,1.14 12.6,0.79 8.84,0.79 8.36,1.27 P2.16
  Bottom 0.152: v44.7,7.87 45.21,8.38 46.48,8.38 46.99,7.87 46.99,6.1 45.34,4.45 v40.39,4.45 | v36.96,4.45 35.69,5.71 v35.69,8.89 | v25.91,7.62 v25.91,8.89 v18.41,8.89 | v14.1,6.1 13.84,5.84 13.84,2.03 v12.95,1.14
CLK  (via drill 0.35)
  Top 0.152: U1.1 42.99,5.02 v42.93,5.08 | v37.08,9.53 35.18,11.43 X1.P$3 | 51.56,21.21 51.56,15.11 50.49,14.05 50.49,10.62 49.54,9.66 46.6,9.66 v46.48,9.55 46.33,9.4 45.09,9.4 44.48,10.01 44.48,13.33 42.42,15.39 42.42,17.14 43.48,18.21 43.48,21.67 42.93,22.23 v42.67,22.23 U14.P$13 | 51.56,21.21 50.55,22.23 U13.P$13 | U13.P$11 v50.55,24.77 51.56,23.75 51.56,21.21 | v42.42,24.77 U14.P$11 | v55.24,28.45 56.39,28.45 60.96,33.02 P4.14
  Bottom 0.152: v42.93,5.08 37.47,5.08 37.08,5.46 v37.08,9.53 37.08,9.37 38.76,7.7 39.32,7.7 40.92,9.3 46.23,9.3 v46.48,9.55 | v42.67,22.23 42.67,24.51 v42.42,24.77 | v55.24,28.45 54.23,28.45 v50.55,24.77
CLK_UART
  Top 0.152: 33.02,57.4 U4.18 | X2.P$3 32.24,58.18 33.02,57.4 | 33.02,57.4 40.26,50.16 52.96,50.16 55.88,47.24 U16.18
CLK_UART0_RX  (via drill 0.35)
  Top 0.152: U4.10 36.24,44.45 38.77,46.98 | v40.77,50.8 40.05,50.8 37.97,52.88 v37.97,53.34 | v35.69,53.34 U4.17 | 38.77,46.98 | v40.77,48.01 39.8,48.01 38.77,46.98
  Bottom 0.152: v37.97,53.34 v35.69,53.34 | v40.77,50.8 v40.77,48.01
CLK_UART1_RX  (via drill 0.35)
  Top 0.152: U16.10 v57.15,35.56 | v58.17,44.45 U16.17
  Bottom 0.152: v57.15,35.56 57.15,39.5 58.17,40.51 v58.17,44.45
DATA0  (via drill 0.35)
  Top 0.152: U1.9 49.39,3.29 48.82,2.72 42.22,2.72 40.26,0.76 22.1,0.76 U5.13 | U3.P$11 26.54,32.38 25.91,31.75 18.8,31.75 18.16,32.38 U2.P$11 v11.43,32.38 | U16.2 50.8,34.04 49.91,34.92 37.85,34.92 37.21,35.56 29.59,35.56 27.94,37.21 U4.2 27.94,40.89 26.29,42.55 16.89,42.55 16.26,41.91 U15.P$3 13.21,41.91 v12.83,42.29
  Bottom 0.152: U5.13 18.8,4.06 17.4,4.06 16.64,4.83 16.64,6.55 12.9,10.29 11.56,10.29 10.54,11.3 9.4,11.3 8.76,11.94 8.76,16.97 9.04,17.25 9.04,26.98 9.96,27.89 9.96,29.46 10.29,29.79 10.29,31.24 v11.43,32.38 11.43,40.51 12.83,41.91 v12.83,42.29 2.54,52.58 2.54,58.42 P3.1
DATA1  (via drill 0.35)
  Top 0.152: U1.10 50.19,3.58 49.02,2.41 42.42,2.41 40.46,0.46 20.75,0.46 19,2.21 19,5.41 | U5.14 21.72,6.22 19.81,6.22 19,5.41 | U3.P$12 26.54,33.66 25.91,33.02 v22.1,33.02 18.8,33.02 18.16,33.66 U2.P$12 v11.99,33.66 | 19,5.41 19,10.74 19.74,11.48 20.75,11.48 21.84,12.57 21.84,13.72 v22.1,13.97 | U16.3 52.07,34.12 49.99,36.2 37.87,36.2 37.21,36.85 30.07,36.85 29.21,37.72 U4.3 29.21,42.04 27.43,43.81 16.89,43.81 16.26,43.18 U15.P$4 v13.72,43.18 | v3.17,56.01 2.29,56.9 2.03,57.15 P3.2
  Bottom 0.152: v11.99,33.66 11.73,33.91 11.73,40.39 13.46,42.11 13.46,42.93 v13.72,43.18 12.37,43.18 3.17,52.37 v3.17,56.01 | v22.1,13.97 22.55,14.43 22.55,32.56 v22.1,33.02
DATA2  (via drill 0.35)
  Top 0.152: U1.7 47.79,3.59 47.22,3.02 41.33,3.02 40.84,2.54 33.4,2.54 32.77,3.17 25.4,3.17 24.51,4.06 22.35,4.06 21.34,5.08 U5.15 | U3.P$13 26.54,34.92 25.91,34.29 18.8,34.29 18.16,34.92 U2.P$13 v12.57,34.92 | U16.4 53.34,33.28 49.15,37.47 37.56,37.47 37.26,37.16 31.04,37.16 30.48,37.72 U4.4 30.48,41.2 25.32,46.35 16.89,46.35 16.26,46.99 U15.P$7 v13.72,46.99 | v3.81,53.47 2.67,54.61 P3.3
  Bottom 0.152: U5.15 18.69,6.71 17.78,6.71 14.48,10.01 14.48,11.81 14.1,12.19 13.59,12.19 12.95,11.56 12.5,11.56 11.38,12.67 11.38,24.43 10.92,24.89 10.92,26.54 12.57,28.19 v12.57,34.92 12.04,35.46 12.04,40.26 12.62,40.84 | 12.62,40.84 | 12.62,40.84 14.35,42.57 14.35,43.69 13.65,44.39 | v13.72,46.99 13.59,46.86 13.59,44.45 13.65,44.39 | v3.81,53.47 3.81,52.17 11.59,44.39 13.65,44.39
DATA3  (via drill 0.35)
  Top 0.152: U1.3 44.59,3.57 44.35,3.33 41.38,3.33 40.89,3.81 33.4,3.81 32.77,4.45 24.77,4.45 19.3,9.91 19.3,10.54 19.94,11.18 21.84,11.18 U5.18 | 14.07,36.83 11.18,36.83 10.54,36.2 U2.P$15 | 14.07,36.83 18.03,36.83 18.67,36.2 U3.P$15 v22.73,36.2 | U16.5 54.61,32.44 48.31,38.73 38.4,38.73 37.13,37.47 32.13,37.47 31.75,37.85 U4.5 31.75,40.36 24.48,47.62 16.89,47.62 16.26,48.26 U15.P$8 v13.21,48.26 11.28,46.33 11.28,39.63 14.07,36.83 | P3.4 v9.27,52.07
  Bottom 0.152: U5.18 24,11.3 24,13.59 23.16,14.43 23.16,32.94 23.5,33.27 23.5,35.43 v22.73,36.2 | v9.27,52.07 13.08,48.26 v13.21,48.26
DATA4  (via drill 0.35)
  Top 0.152: U1.2 43.79,5.23 43.31,5.71 42.55,5.71 41.91,5.08 33.4,5.08 32.77,5.71 24.77,5.71 23.88,6.6 23.88,8 23.24,8.64 21.84,8.64 U5.19 | v20.95,34.92 U3.P$16 18.67,34.92 18.03,35.56 11.18,35.56 10.54,34.92 U2.P$16 4.95,34.92 4.7,35.18 4.7,36.58 4.86,36.74 4.95,36.83 6.99,36.83 8.87,38.71 8.87,46.63 | U16.6 55.88,31.6 47.48,40.01 39.24,40.01 38.13,38.89 U4.6 33.02,39.52 23.64,48.9 11.12,48.9 8.87,46.63 | 8.87,46.63 7.24,48.26 U15.P$13 v4.95,48.26
  Bottom 0.152: U5.19 21.46,11.3 21.46,14.22 22.25,15.01 22.25,31.85 21.46,32.64 21.46,34.42 v20.95,34.92 | v4.95,48.26 2.54,48.26 P3.5
DATA5  (via drill 0.35)
  Top 0.152: U1.4 v45.39,5.54 | v37.85,5.84 37.34,6.35 33.4,6.35 32.77,6.99 25.4,6.99 24.13,8.26 24.13,11.43 U5.20 | v22.86,33.66 U3.P$17 18.67,33.66 18.03,34.29 11.18,34.29 10.54,33.66 U2.P$17 4.95,33.66 4.39,34.21 4.39,36.71 4.82,37.13 6.86,37.13 8.56,38.84 8.56,45.67 7.24,46.99 U15.P$14 v4.7,46.99 4.28,47.41 4.28,48.73 4.45,48.9 10.67,48.9 11.94,50.16 23.29,50.16 32.51,40.95 33.15,40.95 33.45,40.64 U4.7 38.61,40.64 39.24,41.27 46.64,41.27 56.16,31.75 U16.7
  Bottom 0.152: U5.20 v22.86,33.66 | v45.39,5.54 44.68,6.25 38.25,6.25 v37.85,5.84 | P3.6 v4.7,46.99
DATA6  (via drill 0.35)
  Top 0.152: U1.5 46.19,6.13 v46.1,6.22 | v37.85,6.73 36.96,7.62 33.4,7.62 32.77,8.26 25.15,8.26 24.43,8.97 24.43,12.65 21.84,15.24 U5.21 | v20.57,32.38 U3.P$18 18.67,32.38 18.03,33.02 11.18,33.02 10.54,32.38 U2.P$18 4.83,32.38 4.09,33.12 4.09,36.83 4.7,37.44 6.73,37.44 8.26,38.96 8.26,42.16 7.24,43.18 U15.P$17 v4.45,43.18 3.98,43.65 3.98,49.7 4.45,50.16 10.67,50.16 11.94,51.44 20.49,51.44 21.15,50.77 23.54,50.77 32.41,41.91 U4.8 38.61,41.91 39.24,42.55 45.8,42.55 55.32,33.02 U16.8
  Bottom 0.152: U5.21 20.32,32.13 v20.57,32.38 | v37.85,6.73 38.02,6.55 44.8,6.55 45.13,6.22 v46.1,6.22 | v4.45,43.18 2.54,43.18 P3.7
DATA7  (via drill 0.35)
  Top 0.152: v37.85,7.75 35.43,10.16 25.65,10.16 24.74,11.07 24.74,12.78 21.13,16.38 19.81,16.38 19.18,15.75 19.18,13.84 U5.22 | U3.P$19 18.67,31.11 18.03,31.75 v13.97,31.75 11.18,31.75 10.54,31.11 U2.P$19 4.83,31.11 3.79,32.16 3.79,36.96 4.57,37.74 6.61,37.74 7.95,39.09 7.95,41.2 7.24,41.91 U15.P$18 5.08,41.91 4.32,41.91 | U16.9 54.48,34.29 44.96,43.81 39.24,43.81 38.61,43.18 U4.9 32,43.18 23.8,51.38 21.41,51.38 20.09,52.7 11.94,52.7 10.67,51.44 4.45,51.44 3.67,50.66 3.67,42.56 4.32,41.91 | U1.8 48.59,5.38 47.12,6.86 v45.59,6.86 | P3.8 4.32,41.91
  Bottom 0.152: v37.85,7.75 38.73,6.86 v45.59,6.86 | U5.22 19.04,12.7 17.59,14.15 14.48,14.15 14.15,14.48 14.15,16.25 13.31,17.09 13.31,25.27 13.64,25.6 13.64,28.4 13.97,28.73 v13.97,31.75
GND  (via drill 0.35)
  Top 0.152: v23.37,1.78 23.88,1.27 U9.P$7 | v41.91,30.48 43.05,31.62 43.43,31.62 v43.56,31.75
  Top 0.254: v9.53,35.56 10.54,35.56 11.18,36.2 v13.34,36.2 | v28.57,34.29 32,34.29 v32.64,33.66 32,33.02 v28.57,33.02 | v28.7,29.21 v32.38,29.21 | v28.7,27.94 v32.38,27.94 | v28.7,26.67 v32.51,26.67 | v28.7,25.4 v32.51,25.4 | v28.7,24.13 v32.51,24.13 | v28.7,20.32 v32.38,20.32 | v25.53,33.66 25.91,33.66 26.54,34.29 v26.8,34.29 | v25.53,32.38 25.91,32.38 26.54,33.02 v26.8,33.02 | v24.89,28.57 25.91,28.57 26.54,29.21 v26.8,29.21 | v24.89,27.3 25.91,27.3 26.54,27.94 v26.8,27.94 | v24.89,26.04 25.91,26.04 26.54,26.67 v26.8,26.67 | v24.89,24.77 25.91,24.77 26.54,25.4 v26.8,25.4 | v24.89,23.5 25.91,23.5 26.54,24.13 v26.8,24.13 | 45.21,28.45 46.35,28.45 v46.35,31.75 45.09,31.75 45.09,28.57 45.21,28.45 | 45.21,28.45 v45.09,28.32
  Bottom 0.152: v15.62,9.91 15.11,10.41 15.11,11.56 16.64,11.56 16.51,11.68 | 16.51,11.68 14.99,11.68 | 16.51,11.68 17.02,11.68 v18.03,10.67 | v30.1,8.89 30.86,8.89 31.75,8 31.75,3.3 v30.35,1.91 31.11,1.14 32.77,1.14 | 34.67,1.14 32.77,1.14 | 32.77,1.14 32.64,1.27 35.81,1.27 v36.32,1.78 | v23.37,1.78 23.88,1.27 28.32,1.27 v28.45,1.4
  other vias: 13.34,61.59 16.76,62.48 16.89,59.94 14.99,59.94 15.62,61.47 24.77,59.05 27.69,57.91 27.69,60.96 26.29,58.67 29.59,60.33 32,63.12 33.02,58.67 33.53,60.58 31.5,60.71 31.62,59.05 36.07,60.2 36.45,63.12 36.45,58.17 43.81,63.12 44.07,60.58 43.43,57.15 43.43,59.05 48.01,58.93 49.4,55.5 47.75,54.1 49.66,53.47 52.7,53.21 53.21,55.63 53.47,59.05 54.61,57.53 54.74,53.72 56.52,59.18 56.9,56.77 56.9,53.09 59.56,53.34 58.04,54.86 59.18,58.17 59.05,60.07 60.83,59.31 60.96,61.98 59.18,63.63 59.18,61.98 60.83,64.14 58.93,65.79 56.01,64.64 54.48,67.31 56.01,66.8 53.34,64.14 51.05,64.14 48.51,64.14 46.23,64.14 46.35,66.17 48.51,67.06 47.88,65.41 46.86,68.45 49.15,69.34 54.86,69.47 53.09,69.22 51.05,68.58 61.09,66.29 61.09,69.09 59.31,69.34 59.31,72.14 60.96,72.39 60.2,70.74 61.09,75.69 57.78,75.56 54.74,72.26 55.24,75.31 54.23,74.04 52.7,72.52 50.67,72.64 49.15,75.31 49.02,72.52 47.24,74.17 37.08,75.56 40.89,65.41 40.13,66.8 38.86,65.53 37.21,67.31 35.31,65.53 30.1,65.53 26.54,67.94 27.94,66.04 29.59,67.94 34.92,68.96 31.88,69.85 24.51,66.93 21.72,66.93 17.53,68.07 24.51,65.28 18.92,65.41 11.43,65.79 22.48,61.47 22.48,59.69 11.3,59.94 5.84,61.47 5.84,57.28 9.65,61.47 6.86,59.44 8.76,57.4 13.84,57.4 16.76,55.75 19.3,59.56 19.3,61.47 17.27,57.91 11.43,57.4 4.19,54.74 4.7,52.96 1.91,53.47 1.91,56.01 3.43,57.91 4.45,56.39 4.83,59.05 3.05,60.2 4.06,62.1 4.19,64.64 5.84,65.41 7.24,65.02 1.27,61.72 2.41,63.5 1.14,65.91 4.06,66.8 10.41,68.33 14.22,68.45 12.32,68.45 20.32,67.82 23.11,67.94 17.53,69.85 20.32,69.85 23.11,69.85 31.62,57.28 28.57,53.47 34.29,54.86 35.31,56.13 36.96,54.61 38.99,54.1 38.61,59.94 38.61,58.17 38.48,62.99 41.78,62.99 41.66,59.94 41.66,58.17 42.93,53.98 40.64,51.94 41.78,53.09 44.7,53.09 44.58,51.44 42.04,51.18 43.31,52.2 58.17,50.55 59.05,49.4 58.04,48.39 57.02,47.12 56.26,48.51 54.61,50.29 56.52,50.04 54.1,48.01 49.02,49.02 52.2,48.9 50.55,48.26 46.61,48.51 42.04,47.62 37.97,44.7 39.5,45.72 41.78,45.85 40.77,46.74 59.44,45.85 59.18,42.55 44.2,48.01 43.31,44.58 45.72,44.45 46.99,44.45 48.9,44.2 48.9,42.16 50.67,40.64 55.5,44.2 53.47,43.18 52.2,41.91 50.93,43.31 52.2,44.32 38.73,49.15 36.7,49.66 36.83,47.24 32.38,51.82 26.8,51.82 29.72,49.15 29.46,51.05 31.75,47.37 21.34,53.34 20.45,49.53 22.61,48.26 18.29,54.36 19.43,55.37 14.73,52.07 12.45,52.07 12.7,50.8 8.64,50.8 10.54,52.45 13.72,53.85 2.67,50.67 2.67,47.62 2.67,45.85 9.53,49.53 11.43,47.75 12.45,46.23 10.16,43.05 7.49,44.83 8.89,48.01 7.37,49.53 10.41,46.48 2.92,42.55 6.99,42.55 21.46,46.99 20.57,45.09 24.51,45.09 20.57,43.18 23.75,43.18 21.84,41.91 21.08,40.64 18.8,39.62 13.08,40.13 10.29,38.61 10.03,40.64 7.24,40.64 3.43,40.77 3.68,38.23 6.22,38.35 27.18,42.8 28.19,41.78 31.75,50.29 43.94,43.18 44.32,41.91 44.83,40.64 43.56,39.37 46.35,39.37 43.56,38.1 43.56,36.83 43.56,35.56 43.56,34.29 46.35,38.1 46.35,36.83 46.35,35.56 46.35,34.29 43.56,33.02 46.35,33.02 48.9,36.83 49.53,35.56 48.9,34.29 48.9,33.02 50.04,32.38 55.37,42.16 53.85,40.39 53.85,38.73 53.85,36.83 52.58,39.5 59.44,36.32 59.56,33.02 60.2,38.1 59.44,29.97 59.56,27.94 58.55,25.91 56.26,25.91 56.26,21.21 56.26,18.92 58.55,21.21 50.67,20.95 50.67,23.5 51.18,26.8 36.96,30.48 36.96,29.21 36.96,27.94 36.58,26.67 36.32,33.15 38.86,34.16 38.86,35.56 38.86,36.83 36.2,38.23 38.73,38.1 36.58,39.88 39.62,40.64 32.77,36.2 36.07,36.2 29.21,36.83 26.29,37.21 25.91,35.31 22.35,35.05 15.24,36.2 9.53,34.29 9.53,33.02 8.76,31.75 2.79,36.58 2.54,34.67 3.56,26.42 13.34,30.48 23.88,32.38 23.62,36.2 25.53,20.95 26.8,20.32 26.8,22.86 28.7,22.86 32.51,19.05 28.7,19.05 36.07,21.34 36.7,22.99 38.48,21.59 40.26,21.59 42.8,20.95 46.74,27.3 50.67,19.05 41.78,16.89 35.81,16.51 32.77,13.97 30.61,13.97 28.57,13.97 29.21,15.62 26.04,13.97 24.64,16.13 29.21,11.68 25.53,11.68 16.26,18.03 19.3,18.03 14.22,18.03 59.05,17.65 59.31,15.37 58.8,13.34 54.48,12.19 58.29,10.67 51.18,10.16 49.02,13.84 46.61,14.48 44.58,14.48 45.47,11.3 46.61,12.57 47.88,11.05 48.39,8.76 48.51,6.73 50.67,8.64 50.42,5.71 51.18,7.11 52.7,5.08 50.67,2.92 53.09,3.43 56.13,2.16 54.48,0.89 59.31,2.54 59.31,5.08 59.31,7.24 56.77,10.79 42.55,12.83 42.67,10.67 38.1,10.67 35.69,12.45 32.89,10.79 36.32,8.26 36.32,6.99 35.69,3.17 38.23,3.17 27.94,3.81 29.21,5.08 29.08,7.62 25.15,9.65 28.45,9.53 24.13,3.43 24.51,6.86 21.59,2.29 21.46,6.86 18.8,1.02 16.51,1.27 14.48,4.19 14.35,1.02 12.06,3.81 9.27,3.68 12.7,7.62 6.6,2.16 3.56,2.67 3.56,5.08 5.46,6.35 2.79,7.62 2.79,10.16 2.41,13.46 1.65,15.24 5.21,17.65 16.13,16.64 19.94,13.97 18.41,16.38 24.13,53.59 26.92,19.05 23.88,31.11 21.46,31.11 21.46,28.57 21.46,27.3 21.46,26.04 21.46,24.77 21.46,23.5 21.21,18.03 54.1,27.3 5.08,68.83 7.75,70.36 13.46,70.99
  pour Top (isolate 0.305): 0,0 0,76.83 62.23,76.83 62.23,0
  pour Bottom (isolate 0.305): 0,76.83 62.23,76.83 62.23,0 0,0
INT_DEV  (via drill 0.35)
  Top 0.152: U10.P$6 38.48,19.05 37.9,19.63 37.9,23.44 v37.85,23.5 | v37.85,26.67 U12.P$4
  Bottom 0.152: v37.85,23.5 v37.85,26.67
INT_EN  (via drill 0.35)
  Top 0.152: U15.P$5 12.95,44.45 12.19,43.69 12.19,40.01 14.45,37.74 18.41,37.74 18.72,37.44 25.17,37.44 27.05,35.56 v28.57,35.56 | v32.51,34.92 36.2,34.92 v37.85,33.27 | v38.48,27.94 U12.P$5
  Bottom 0.152: v28.57,35.56 29.21,34.92 v32.51,34.92 | v37.85,33.27 37.85,28.57 v38.48,27.94
INT_UART  (via drill 0.35)
  Top 0.152: U10.P$4 v40.13,16.51 | v40.13,15.24 U10.P$3
  Bottom 0.152: v40.13,16.51 v40.13,15.24
INT_UART0  (via drill 0.35)
  Top 0.152: U4.33 v20.45,48.26 | v21.72,49.53 23.44,49.53 32.33,40.64 33.02,40.64 34.47,39.2 37.42,39.2 v38.1,39.88 | U10.P$1 v39.88,12.7
  Bottom 0.152: v20.45,48.26 v21.72,49.53 | v38.1,39.88 39.83,38.15 39.83,25.65 39.19,25.02 39.19,13.39 v39.88,12.7
INT_UART1  (via drill 0.35)
  Top 0.152: U16.33 v40.13,39.37 | U10.P$2 v39.88,13.97
  Bottom 0.152: v40.13,39.37 40.13,25.53 39.5,24.89 39.5,14.35 v39.88,13.97
N$1
  Top 0.61: R1.2 D2.1
N$2
  Top 0.61: D1.1 R2.2
N$3  (via drill 0.35)
  Top 0.152: U14.P$12 v41.02,23.5 | v45.97,26.67 47.88,26.67 48.51,27.3 U13.P$9
  Bottom 0.152: v45.97,26.67 43.11,26.67 41.02,24.59 v41.02,23.5
N$4
  Top 0.813: J1.PWR 46.97,70.87 S1.2
N$5
  Top 0.406: U8.P$4 9.53,54.74 9.27,54.48 9.27,53.96 C24.2
N$6
  Top 0.406: U8.P$5 10.79,54.74 11.18,54.36 11.18,53.86 C24.1
N$7
  Top 0.406: U8.P$3 8.26,54.74 7.87,54.36 7.87,53.86 C22.1
N$8
  Top 0.406: U8.P$1 5.71,53.99 C22.2
N$9  (via drill 0.35)
  Top 0.406: U8.P$2 6.99,57.4 8.26,58.67 v12.06,58.67 | v16.64,58.67 C23.1
  Bottom 0.406: v12.06,58.67 v16.64,58.67
N$10
  Top 0.406: U8.P$6 12.06,54.74 12.45,54.36 12.45,53.99 C25.2
N$11
  Top 0.254: U8.P$14 8.26,64.39 11.05,67.18 19.03,67.18 J2.3
N$12
  Top 0.254: J2.2 21.84,64.64 10.03,64.64 9.53,64.14 U8.P$13
RESET  (via drill 0.35)
  Top 0.152: v19.3,54.36 20,53.66 20.02,53.65 21.67,51.99 24.05,51.99 31.59,44.45 v32.26,44.45 | U4.39 v18.03,40.64 | U16.39 v34.67,31.75 | U12.P$3 v35.56,25.4
  Bottom 0.152: v19.3,54.36 19.3,51.69 17.53,49.91 17.53,41.15 v18.03,40.64 | v35.56,25.4 33.91,27.05 33.91,30.99 v34.67,31.75 34.67,42.04 v32.26,44.45
ROM_EN
  Top 0.152: U9.P$9 U9.P$6
SCR0_CP  (via drill 0.35)
  Top 0.152: U15.P$11 v6.99,50.8 | v24.89,29.84 25.91,29.84 26.54,30.48 U12.P$8 | v24.51,36.32 24,36.83 18.46,36.83 18.16,37.13 14.2,37.13 11.58,39.75 11.58,44.6 v11.94,44.96
  Bottom 0.152: v24.51,36.32 24.51,30.23 v24.89,29.84 | v6.99,50.8 11.94,45.85 v11.94,44.96
TIMER_OUT  (via drill 0.35)
  Top 0.152: U14.P$7 v46.61,26.04 | v40.13,17.78 U10.P$5
  Bottom 0.152: v46.61,26.04 42.9,26.04 41.86,25 41.86,19.51 v40.13,17.78
UART0_RX
  Top 0.152: U8.P$12 10.79,62.1 15.88,57.02 22.99,57.02 23.5,56.52 23.5,53.41 31.18,45.72 U4.11
UART0_TX
  Top 0.152: U8.P$11 12.06,61.26 16,57.33 23.95,57.33 24.77,56.52 24.77,52.57 29.08,48.26 U4.13
UART1_RX
  Top 0.152: U16.11 58.93,36.83 59.44,37.34 59.44,40.39 P1.3
UART1_TX
  Top 0.152: U16.13 58.93,39.37 59.13,39.57 59.13,40.51 59.82,41.2 59.82,43.31 P1.2
VCC  (via drill 0.35)
  Top 0.254: U1.6 v46.99,3.68
  Top 0.406: v5.71,64.14 U8.P$16 | v57.02,41.91 U16.15 U16.14 | U4.14 U4.15 v37.34,50.8 | v25.4,40.39 U4.44 | v7.11,39.37 U15.P$20 | v5.21,19.68 U2.P$28 | v19.18,19.68 U3.P$28 v25.4,19.68 | v26.16,17.14 27.05,16.51 X1.P$1 X1.P$4 | U12.P$14 v32.51,22.86 | U10.P$14 v32.89,12.7 | v32.38,8.89 U9.P$14 | v33.27,1.91 U11.P$16 | U13.P$16 v49.78,18.41 | U14.P$16 v42.04,18.41 | U16.44 v48.26,31.11
  Top 0.61: C19.2 C23.2 C20.2 C21.2 20.32,62.5 20.32,63.12 20.95,63.75 | R2.1 23.48,63.13 | 23.48,63.13 22.86,63.75 20.95,63.75 | 32.92,64.26 X2.P$1 X2.P$4 37.61,55.37 41.27,55.37 | 23.48,63.13 23.48,63.23 24.51,64.26 32.92,64.26 | 40.13,62.87 C10.2 C11.2 | 40.13,62.87 C14.2 C26.2 | C26.2 C11.2 | 39.62,59.05 C9.2 39.61,57.17 39.62,57.15 | 39.62,59.05 C27.2 | 39.62,57.15 C8.2 | 39.62,57.15 C15.2 C27.2 | C27.2 C26.2 | C11.2 39.61,59.07 39.62,59.05 | 40.13,62.87 40.13,56.52 41.27,55.37 | 41.27,55.37 v42.16,55.37 | 40.13,62.87 40.13,63.5 39.37,64.26 | 39.37,64.26 32.92,64.26 | 46.66,61.27 C1.2 44.37,64.26 39.37,64.26 | 45.72,59.44 45.72,58.29 | 45.59,58.17 45.11,57.68 U7.4 45.14,56.92 | 20.95,63.75 v16.38,63.75 | v14.73,38.48 v18.92,38.48 | v12.68,37.44 9.17,37.44 v9.14,37.47 | C7.2 58.28,24.38 v57.4,24.38 56.66,24.38 C6.2
  Top 0.813: C5.2 v48.9,51.82 C2.2 45.11,54.7 45.11,55.37 U7.4
  Top 1.016: 46.99,56.9 U7.4 | 46.99,56.9 48.26,56.9 | 48.26,56.9 51.38,56.9 U7.2 | v42.16,55.37 43.59,55.37 | 43.59,55.37 U7.4 | 43.59,55.37 45.11,55.37 | 43.59,55.37 44.26,54.7 45.11,54.7 46.19,54.7 48.26,56.77 48.26,56.9 | 47.37,56.01 48.26,56.9 | 47.37,56.01 46.99,55.63 45.97,55.63 45.97,56.26 | 45.97,56.26 46.1,56.39 | 45.97,56.26 47.12,56.26 47.37,56.01 | 48.26,56.9 46.99,58.17 | 46.8,58.36 45.72,59.44 45.72,60.33 46.66,61.27 | 45.72,59.82 45.72,58.29 45.59,58.17 | U7.4 46.57,58.36 46.8,58.36 | 46.8,58.36 46.99,58.17 | 46.99,57.4 46.99,58.17 | 46.99,57.4 46.99,56.9 | U7.4 45.62,57.4 46.99,57.4
  Bottom 0.406: v9.14,37.47 2.29,30.61 2.29,20.07 2.79,19.56 5.08,19.56 v5.21,19.68 6.1,18.8 6.1,12.79 7.62,11.26 U5.32 | v18.92,38.48 18.92,19.94 v19.18,19.68 | v32.51,22.86 31.62,23.75 | 32.89,49.78 32.64,49.53 32.64,46.1 31.37,44.83 31.37,43.05 33.66,40.77 33.66,33.15 31.62,31.11 31.62,23.75 | 31.62,23.75 31.62,13.97 | 31.62,13.97 v32.89,12.7 | 31.62,13.97 31.62,9.65 v32.38,8.89 32.38,2.79 v33.27,1.91 | v25.4,19.68 26.04,19.05 26.04,17.4 26.16,17.27 v26.16,17.14
  Bottom 0.61: v16.38,63.75 6.1,63.75 v5.71,64.14 | v42.16,55.37 37.59,50.8 v37.34,50.8 33.91,50.8 32.89,49.78 25.4,42.29 | 25.4,42.29 v25.4,40.39 | 25.4,42.29 21.59,38.48 v18.92,38.48 | v14.73,38.48 13.69,37.44 v12.68,37.44 | v9.14,37.47 9.02,37.47 v7.11,39.37 | v48.9,51.82 47.88,50.8 47.88,31.11 | 47.88,20.32 47.88,12.83 49.66,11.05 49.66,6.35 v46.99,3.68 | v49.78,18.41 47.88,20.32 | v42.04,18.41 47.88,24.26 | P6.6 v57.4,24.38 57.4,32.38 55.12,34.67 55.12,40.01 v57.02,41.91 57.02,45.59 P5.4 | v48.26,31.11 47.88,31.11 | 47.88,20.32 47.88,24.26 | 47.88,24.26 47.88,31.11
  Bottom 0.813: v48.9,51.82 58.67,51.82 P5.4
VIN  (via drill 0.35)
  Top 0.61: C4.2 v52.07,60.45 52.07,59.87 U7.3 | U7.3 52.17,59.21 | 57.48,61.21 C3.2 | U7.3 49.25,59.21 48.26,60.2 v48.26,61.98 | v27.56,62.48 R1.1
  Top 0.813: S1.1 57.48,67.83 C3.2 v57.48,60.45 57.48,58.09 P5.2
  Bottom 0.61: v48.26,61.98 28.07,61.98 v27.56,62.48
  Bottom 0.813: v57.48,60.45 v52.07,60.45

## Text on the board
tPlace: Reset | VIN: 6.5V | Power | 1uF | 1uF | 1uF | 1uF | 1k | 1k | 100uF | Rizon | 1uF | 18.432Mhz | 100uF | MAX232 | 100nF | VCC | VIN | 100nF | 1uF | 1uF | 100nF | 1uF | NCP1117 / 5.0V REG | 1uF | 1uF | 1uF | 10uF | 1uF | 16550 / UART | 16550 / UART | 74273 | 7400 | 74590 | 74590 | 1uF | 100nF | AS6C62256 / 32kb SRAM | AS6C62256 / 32kb SRAM | 7432 | 4.0Mhz | Z80 / CPU | 74138 | 7400 | AT28 / C64B / ROM | 10k
bPlace: GND | VIN | DATA[0..7] | GND | VCC | GND | UART1_TX | UART1_RX | GND | !ROM_EN | CLK | !RFSH | !M1 | !RD | !WR | !BUSACK | !BUSREQ | ADDR[0..15] | Rizon Z80 Computer / Z80 @ 4.0Mhz / 64kb SRAM / 8kb EEPROM / 2 x UART / Power: DC 6.5V 1A | !RESET | !IORQ | !MREQ | !HALT | !WAIT | !NMI | !INT